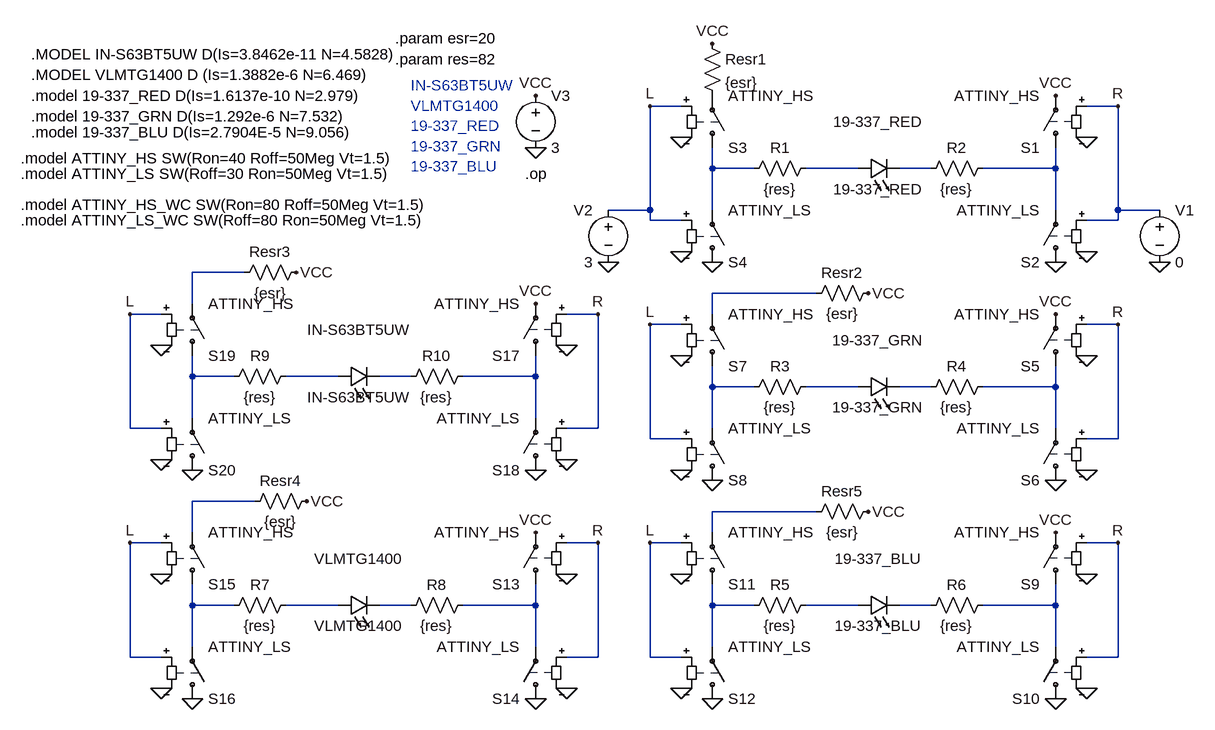
[diagram p0: schematic FWA_2020-2022_Compass_Charlieplex_LED_Currents.asc]
FWA_2020-2022_Compass_Charlieplex_LED_Currents.asc, the LTspice schematic file:
Version 4
SHEET 1 880 680
WIRE -32 -256 -80 -256
WIRE 640 -256 592 -256
WIRE 16 -160 16 -192
WIRE 80 -160 16 -160
WIRE 240 -160 160 -160
WIRE 352 -160 304 -160
WIRE 544 -160 544 -192
WIRE 544 -160 432 -160
WIRE -80 -96 -80 -256
WIRE -80 -96 -144 -96
WIRE 16 -96 16 -160
WIRE 544 -96 544 -160
WIRE 640 -96 640 -256
WIRE 704 -96 640 -96
WIRE -80 -80 -80 -96
WIRE -32 -80 -80 -80
WIRE 640 -80 640 -96
WIRE 640 -80 592 -80
WIRE -704 0 -784 0
WIRE 176 32 16 32
WIRE -784 48 -784 0
WIRE -832 64 -880 64
WIRE -160 64 -208 64
WIRE 16 64 16 32
WIRE -32 80 -80 80
WIRE 640 80 592 80
WIRE -784 160 -784 128
WIRE -720 160 -784 160
WIRE -560 160 -640 160
WIRE -448 160 -496 160
WIRE -256 160 -256 128
WIRE -256 160 -368 160
WIRE 16 176 16 144
WIRE 80 176 16 176
WIRE 240 176 160 176
WIRE 352 176 304 176
WIRE 544 176 544 144
WIRE 544 176 432 176
WIRE -784 224 -784 160
WIRE -256 224 -256 160
WIRE -880 240 -880 64
WIRE -832 240 -880 240
WIRE -160 240 -160 64
WIRE -160 240 -208 240
WIRE 16 240 16 176
WIRE 544 240 544 176
WIRE -80 256 -80 80
WIRE -32 256 -80 256
WIRE 640 256 640 80
WIRE 640 256 592 256
WIRE -688 352 -784 352
WIRE 176 368 16 368
WIRE -784 400 -784 352
WIRE 16 400 16 368
WIRE -832 416 -880 416
WIRE -160 416 -208 416
WIRE -32 416 -80 416
WIRE 640 416 592 416
WIRE -784 512 -784 480
WIRE -720 512 -784 512
WIRE -560 512 -640 512
WIRE -448 512 -496 512
WIRE -256 512 -256 480
WIRE -256 512 -368 512
WIRE 16 512 16 480
WIRE 80 512 16 512
WIRE 240 512 160 512
WIRE 352 512 304 512
WIRE 544 512 544 480
WIRE 544 512 432 512
WIRE -784 576 -784 512
WIRE -256 576 -256 512
WIRE 16 576 16 512
WIRE 544 576 544 512
WIRE -880 592 -880 416
WIRE -832 592 -880 592
WIRE -160 592 -160 416
WIRE -160 592 -208 592
WIRE -80 592 -80 416
WIRE -32 592 -80 592
WIRE 640 592 640 416
WIRE 640 592 592 592
FLAG 544 -16 0
FLAG 592 -208 0
FLAG 592 -32 0
FLAG 544 -272 VCC
FLAG 704 -16 0
FLAG 16 -16 0
FLAG -32 -208 0
FLAG -32 -32 0
FLAG 16 -352 VCC
FLAG -144 -16 0
FLAG -256 -192 0
FLAG -256 -272 VCC
FLAG -80 -256 L
FLAG 640 -256 R
FLAG 544 320 0
FLAG 592 128 0
FLAG 592 304 0
FLAG 544 64 VCC
FLAG 16 320 0
FLAG -32 128 0
FLAG -32 304 0
FLAG -80 80 L
FLAG 640 80 R
FLAG 544 656 0
FLAG 592 464 0
FLAG 592 640 0
FLAG 544 400 VCC
FLAG 16 656 0
FLAG -32 464 0
FLAG -32 640 0
FLAG -80 416 L
FLAG 640 416 R
FLAG -256 656 0
FLAG -208 464 0
FLAG -208 640 0
FLAG -256 400 VCC
FLAG -784 656 0
FLAG -832 464 0
FLAG -832 640 0
FLAG -880 416 L
FLAG -160 416 R
FLAG -256 304 0
FLAG -208 112 0
FLAG -208 288 0
FLAG -256 48 VCC
FLAG -784 304 0
FLAG -832 112 0
FLAG -832 288 0
FLAG -880 64 L
FLAG -160 64 R
FLAG 256 32 VCC
FLAG -624 0 VCC
FLAG -608 352 VCC
FLAG 256 368 VCC
SYMBOL LED 240 -144 R270
WINDOW 0 72 32 VTop 2
WINDOW 3 0 32 VBottom 2
SYMATTR InstName 19-337_RED
SYMATTR Value 19-337_RED
SYMBOL sw 544 -176 R180
SYMATTR InstName S1
SYMATTR Value ATTINY_HS
SYMBOL sw 544 0 R180
SYMATTR InstName S2
SYMATTR Value ATTINY_LS
SYMBOL voltage 704 -112 R0
SYMATTR InstName V1
SYMATTR Value 0
SYMBOL sw 16 -176 M180
SYMATTR InstName S3
SYMATTR Value ATTINY_HS
SYMBOL sw 16 0 M180
SYMATTR InstName S4
SYMATTR Value ATTINY_LS
SYMBOL voltage -144 -112 M0
SYMATTR InstName V2
SYMATTR Value 3
SYMBOL res 176 -176 R90
WINDOW 0 0 56 VBottom 2
WINDOW 3 32 56 VTop 2
SYMATTR InstName R1
SYMATTR Value {res}
SYMBOL res 448 -176 R90
WINDOW 0 0 56 VBottom 2
WINDOW 3 32 56 VTop 2
SYMATTR InstName R2
SYMATTR Value {res}
SYMBOL voltage -256 -288 R0
SYMATTR InstName V3
SYMATTR Value 3
SYMBOL LED 240 192 R270
WINDOW 0 72 32 VTop 2
WINDOW 3 0 32 VBottom 2
SYMATTR InstName 19-337_GRN
SYMATTR Value 19-337_GRN
SYMBOL sw 544 160 R180
SYMATTR InstName S5
SYMATTR Value ATTINY_HS
SYMBOL sw 544 336 R180
SYMATTR InstName S6
SYMATTR Value ATTINY_LS
SYMBOL sw 16 160 M180
SYMATTR InstName S7
SYMATTR Value ATTINY_HS
SYMBOL sw 16 336 M180
SYMATTR InstName S8
SYMATTR Value ATTINY_LS
SYMBOL res 176 160 R90
WINDOW 0 0 56 VBottom 2
WINDOW 3 32 56 VTop 2
SYMATTR InstName R3
SYMATTR Value {res}
SYMBOL res 448 160 R90
WINDOW 0 0 56 VBottom 2
WINDOW 3 32 56 VTop 2
SYMATTR InstName R4
SYMATTR Value {res}
SYMBOL LED 240 528 R270
WINDOW 0 72 32 VTop 2
WINDOW 3 0 32 VBottom 2
SYMATTR InstName 19-337_BLU
SYMATTR Value 19-337_BLU
SYMBOL sw 544 496 R180
SYMATTR InstName S9
SYMATTR Value ATTINY_HS
SYMBOL sw 544 672 R180
SYMATTR InstName S10
SYMATTR Value ATTINY_LS
SYMBOL sw 16 496 M180
SYMATTR InstName S11
SYMATTR Value ATTINY_HS
SYMBOL sw 16 672 M180
SYMATTR InstName S12
SYMATTR Value ATTINY_LS
SYMBOL res 176 496 R90
WINDOW 0 0 56 VBottom 2
WINDOW 3 32 56 VTop 2
SYMATTR InstName R5
SYMATTR Value {res}
SYMBOL res 448 496 R90
WINDOW 0 0 56 VBottom 2
WINDOW 3 32 56 VTop 2
SYMATTR InstName R6
SYMATTR Value {res}
SYMBOL LED -560 528 R270
WINDOW 0 72 32 VTop 2
WINDOW 3 0 32 VBottom 2
SYMATTR InstName VLMTG1400
SYMATTR Value VLMTG1400
SYMBOL sw -256 496 R180
SYMATTR InstName S13
SYMATTR Value ATTINY_HS
SYMBOL sw -256 672 R180
SYMATTR InstName S14
SYMATTR Value ATTINY_LS
SYMBOL sw -784 496 M180
SYMATTR InstName S15
SYMATTR Value ATTINY_HS
SYMBOL sw -784 672 M180
SYMATTR InstName S16
SYMATTR Value ATTINY_LS
SYMBOL res -624 496 R90
WINDOW 0 0 56 VBottom 2
WINDOW 3 32 56 VTop 2
SYMATTR InstName R7
SYMATTR Value {res}
SYMBOL res -352 496 R90
WINDOW 0 0 56 VBottom 2
WINDOW 3 32 56 VTop 2
SYMATTR InstName R8
SYMATTR Value {res}
SYMBOL LED -560 176 R270
WINDOW 0 72 32 VTop 2
WINDOW 3 0 32 VBottom 2
SYMATTR InstName IN-S63BT5UW
SYMATTR Value IN-S63BT5UW
SYMBOL sw -256 144 R180
SYMATTR InstName S17
SYMATTR Value ATTINY_HS
SYMBOL sw -256 320 R180
SYMATTR InstName S18
SYMATTR Value ATTINY_LS
SYMBOL sw -784 144 M180
SYMATTR InstName S19
SYMATTR Value ATTINY_HS
SYMBOL sw -784 320 M180
SYMATTR InstName S20
SYMATTR Value ATTINY_LS
SYMBOL res -624 144 R90
WINDOW 0 0 56 VBottom 2
WINDOW 3 32 56 VTop 2
SYMATTR InstName R9
SYMATTR Value {res}
SYMBOL res -352 144 R90
WINDOW 0 0 56 VBottom 2
WINDOW 3 32 56 VTop 2
SYMATTR InstName R10
SYMATTR Value {res}
SYMBOL res 0 -368 R0
SYMATTR InstName Resr1
SYMATTR Value {esr}
SYMBOL res 272 16 R90
WINDOW 0 0 56 VBottom 2
WINDOW 3 32 56 VTop 2
SYMATTR InstName Resr2
SYMATTR Value {esr}
SYMBOL res -608 -16 R90
WINDOW 0 0 56 VBottom 2
WINDOW 3 32 56 VTop 2
SYMATTR InstName Resr3
SYMATTR Value {esr}
SYMBOL res -592 336 R90
WINDOW 0 0 56 VBottom 2
WINDOW 3 32 56 VTop 2
SYMATTR InstName Resr4
SYMATTR Value {esr}
SYMBOL res 272 352 R90
WINDOW 0 0 56 VBottom 2
WINDOW 3 32 56 VTop 2
SYMATTR InstName Resr5
SYMATTR Value {esr}
TEXT -1048 -176 Left 2 !.model ATTINY_HS SW(Ron=40 Roff=50Meg Vt=1.5)
TEXT -1048 -152 Left 2 !.model ATTINY_LS SW(Roff=30 Ron=50Meg Vt=1.5)
TEXT -272 -152 Left 2 !.op
TEXT -448 -288 Left 2 ;IN-S63BT5UW\nVLMTG1400\n19-337_RED\n19-337_GRN\n19-337_BLU
TEXT -1032 -272 Left 2 !.model 19-337_RED D(Is=1.6137e-10 N=2.979)
TEXT -1032 -240 Left 2 !.model 19-337_GRN D(Is=1.292e-6 N=7.532)
TEXT -1032 -216 Left 2 !.model 19-337_BLU D(Is=2.7904E-5 N=9.056)
TEXT -1032 -336 Left 2 !.MODEL IN-S63BT5UW D(Is=3.8462e-11 N=4.5828)
TEXT -1032 -304 Left 2 !.MODEL VLMTG1400 D (Is=1.3882e-6 N=6.469)
TEXT -1048 -104 Left 2 !.model ATTINY_HS_WC SW(Ron=80 Roff=50Meg Vt=1.5)
TEXT -1048 -80 Left 2 !.model ATTINY_LS_WC SW(Roff=80 Ron=50Meg Vt=1.5)
TEXT -472 -328 Left 2 !.param res=82
TEXT -472 -360 Left 2 !.param esr=20

The netlist it stands for:
* FWA_2020-2022_Compass_Charlieplex_LED_Currents.asc
D§19-337_RED N002 N003 19-337_RED
S1 N004 VCC R 0 ATTINY_HS
S2 0 N004 R 0 ATTINY_LS
V1 R 0 0
S3 N001 P001 L 0 ATTINY_HS
S4 0 N001 L 0 ATTINY_LS
V2 L 0 3
R1 N002 N001 {res}
R2 N004 N003 {res}
V3 VCC 0 3
D§19-337_GRN N012 N013 19-337_GRN
S5 N014 VCC R 0 ATTINY_HS
S6 0 N014 R 0 ATTINY_LS
S7 N011 N006 L 0 ATTINY_HS
S8 0 N011 L 0 ATTINY_LS
R3 N012 N011 {res}
R4 N014 N013 {res}
D§19-337_BLU N022 N023 19-337_BLU
S9 N024 VCC R 0 ATTINY_HS
S10 0 N024 R 0 ATTINY_LS
S11 N021 N016 L 0 ATTINY_HS
S12 0 N021 L 0 ATTINY_LS
R5 N022 N021 {res}
R6 N024 N023 {res}
D§VLMTG1400 N018 N019 VLMTG1400
S13 N020 VCC R 0 ATTINY_HS
S14 0 N020 R 0 ATTINY_LS
S15 N017 N015 L 0 ATTINY_HS
S16 0 N017 L 0 ATTINY_LS
R7 N018 N017 {res}
R8 N020 N019 {res}
D§IN-S63BT5UW N008 N009 IN-S63BT5UW
S17 N010 VCC R 0 ATTINY_HS
S18 0 N010 R 0 ATTINY_LS
S19 N007 N005 L 0 ATTINY_HS
S20 0 N007 L 0 ATTINY_LS
R9 N008 N007 {res}
R10 N010 N009 {res}
Resr1 VCC P001 {esr}
Resr2 VCC N006 {esr}
Resr3 VCC N005 {esr}
Resr4 VCC N015 {esr}
Resr5 VCC N016 {esr}
.model D D
.lib standard.dio
.model ATTINY_HS SW(Ron=40 Roff=50Meg Vt=1.5)
.model ATTINY_LS SW(Roff=30 Ron=50Meg Vt=1.5)
.op
* IN-S63BT5UW
* VLMTG1400
* 19-337_RED
* 19-337_GRN
* 19-337_BLU
.model 19-337_RED D(Is=1.6137e-10 N=2.979)
.model 19-337_GRN D(Is=1.292e-6 N=7.532)
.model 19-337_BLU D(Is=2.7904E-5 N=9.056)
.MODEL IN-S63BT5UW D(Is=3.8462e-11 N=4.5828)
.MODEL VLMTG1400 D (Is=1.3882e-6 N=6.469)
.model ATTINY_HS_WC SW(Ron=80 Roff=50Meg Vt=1.5)
.model ATTINY_LS_WC SW(Roff=80 Ron=50Meg Vt=1.5)
.param res=82
.param esr=20
.backanno
.end